# Altium schematic sheet LED.SchDoc
size A2
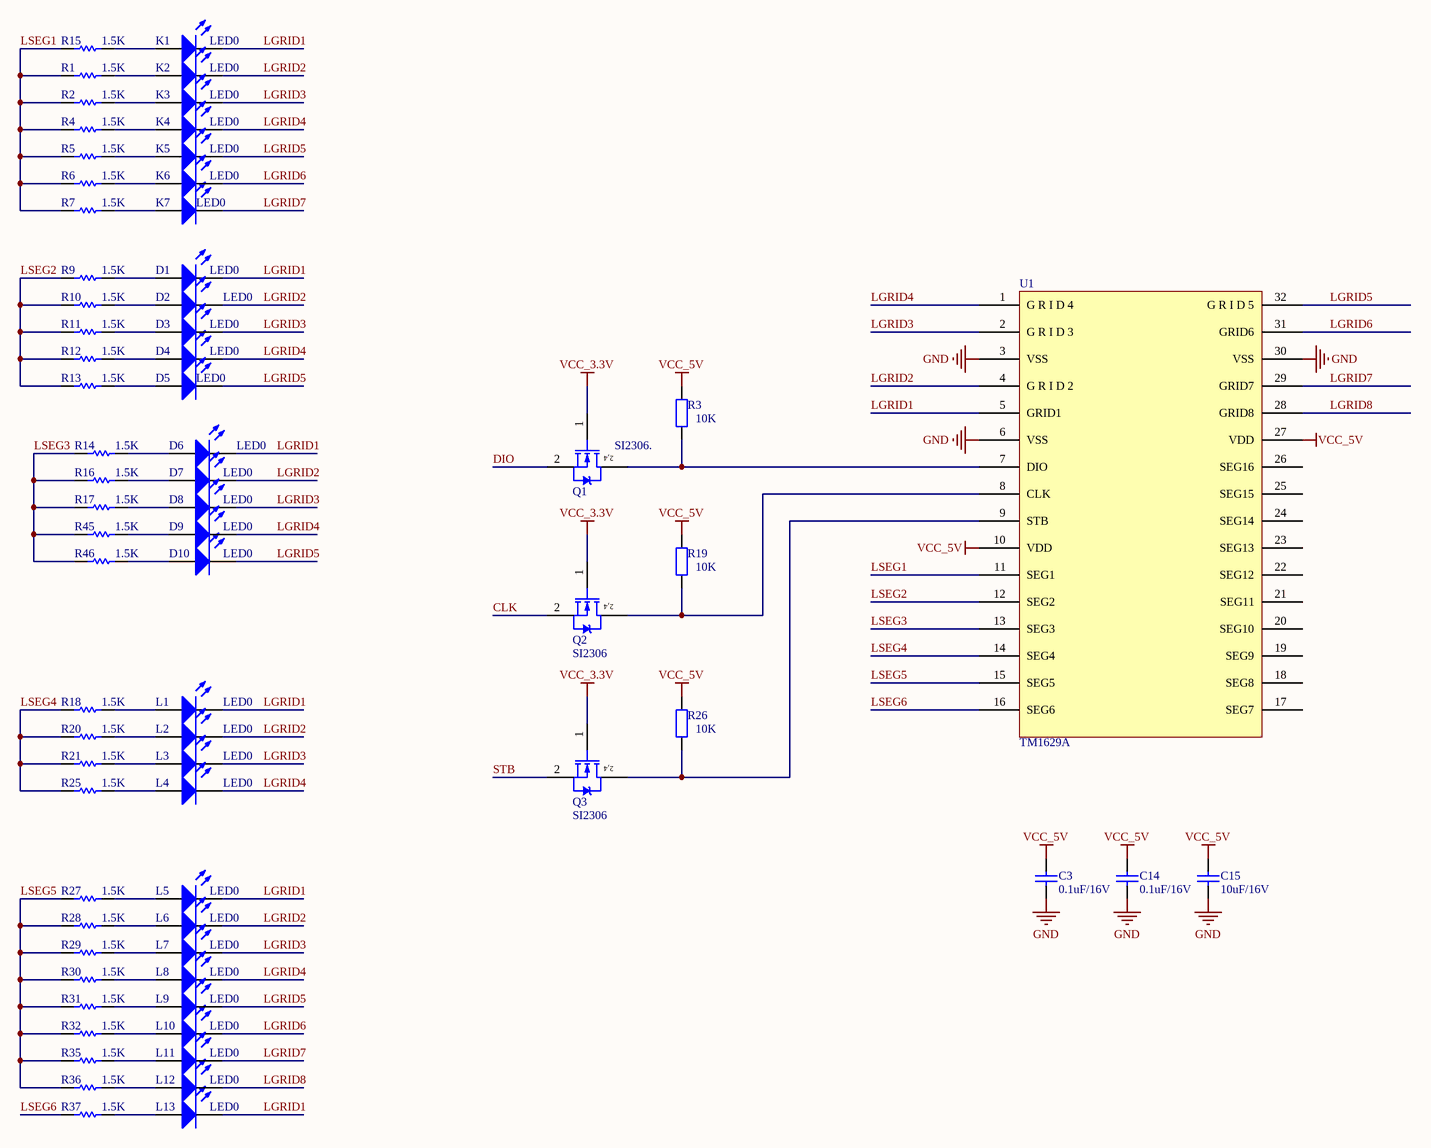
[diagram p0: LED.SchDoc]

## Parts
C3  0.1uF/16V  [0603C]
C14  0.1uF/16V  [0603C]
C15  10uF/16V  [0603C]
D1  LED0  [LED_DIP_257mm]
D2  LED0  [LED_DIP_257mm]
D3  LED0  [LED_DIP_257mm]
D4  LED0  [LED_DIP_257mm]
D5  LED0  [LED_DIP_257mm]
D6  LED0  [LED_DIP_257mm]
D7  LED0  [LED_DIP_257mm]
D8  LED0  [LED_DIP_257mm]
D9  LED0  [LED_DIP_257mm]
D10  LED0  [LED_DIP_257mm]
K1  LED0  [LED_DIP_5mm]
K2  LED0  [LED_DIP_5mm]
K3  LED0  [LED_DIP_5mm]
K4  LED0  [LED_DIP_5mm]
K5  LED0  [LED_DIP_5mm]
K6  LED0  [LED_DIP_5mm]
K7  LED0  [LED_DIP_5mm]
L1  LED0  [LED_DIP_5mm]
L2  LED0  [LED_DIP_5mm]
L3  LED0  [LED_DIP_5mm]
L4  LED0  [LED_DIP_5mm]
L5  LED0  [LED_DIP_257mm]
L6  LED0  [LED_DIP_257mm]
L7  LED0  [LED_DIP_257mm]
L8  LED0  [LED_DIP_257mm]
L9  LED0  [LED_DIP_257mm]
L10  LED0  [LED_DIP_257mm]
L11  LED0  [LED_DIP_257mm]
L12  LED0  [LED_DIP_257mm]
L13  LED0  [LED_DIP_257mm]
Q1  SI2306.  [SOT23-3]
Q2  SI2306  [SOT23-3]
Q3  SI2306  [SOT23-3]
R1  1.5K  [0603R]
R2  1.5K  [0603R]
R3  10K  [0603R]
R4  1.5K  [0603R]
R5  1.5K  [0603R]
R6  1.5K  [0603R]
R7  1.5K  [0603R]
R9  1.5K  [0603R]
R10  1.5K  [0603R]
R11  1.5K  [0603R]
R12  1.5K  [0603R]
R13  1.5K  [0603R]
R14  1.5K  [0603R]
R15  1.5K  [0603R]
R16  1.5K  [0603R]
R17  1.5K  [0603R]
R18  1.5K  [0603R]
R19  10K  [0603R]
R20  1.5K  [0603R]
R21  1.5K  [0603R]
R25  1.5K  [0603R]
R26  10K  [0603R]
R27  1.5K  [0603R]
R28  1.5K  [0603R]
R29  1.5K  [0603R]
R30  1.5K  [0603R]
R31  1.5K  [0603R]
R32  1.5K  [0603R]
R35  1.5K  [0603R]
R36  1.5K  [0603R]
R37  1.5K  [0603R]
R45  1.5K  [0603R]
R46  1.5K  [0603R]
U1  TM1629A  [SOP127P1040X265-32N]

## Nets
GND: C3.2 C14.2 C15.2 U1.3(VSS) U1.6(VSS) U1.30(VSS)
VCC_3.3V: Q1.1(G) Q2.1(G) Q3.1(G)
VCC_5V: C3.1 C14.1 C15.1 R3.1 R19.1 R26.1 U1.10(VDD) U1.27(VDD)
CLK: Q2.2(S)
DIO: Q1.2(S)
LGRID1: D1.2(K) D6.2(K) K1.2(K) L1.2(K) L5.2(K) L13.2(K) U1.5(GRID1)
LGRID2: D2.2(K) D7.2(K) K2.2(K) L2.2(K) L6.2(K) U1.4(G_R_I_D_2)
LGRID3: D3.2(K) D8.2(K) K3.2(K) L3.2(K) L7.2(K) U1.2(G_R_I_D_3)
LGRID4: D4.2(K) D9.2(K) K4.2(K) L4.2(K) L8.2(K) U1.1(G_R_I_D_4)
LGRID5: D5.2(K) D10.2(K) K5.2(K) L9.2(K) U1.32(G_R_I_D_5)
LGRID6: K6.2(K) L10.2(K) U1.31(GRID6)
LGRID7: K7.2(K) L11.2(K) U1.29(GRID7)
LGRID8: L12.2(K) U1.28(GRID8)
LSEG1: R1.2 R2.2 R4.2 R5.2 R6.2 R7.2 R15.2 U1.11(SEG1)
LSEG2: R9.2 R10.2 R11.2 R12.2 R13.2 U1.12(SEG2)
LSEG3: R14.2 R16.2 R17.2 R45.2 R46.2 U1.13(SEG3)
LSEG4: R18.2 R20.2 R21.2 R25.2 U1.14(SEG4)
LSEG5: R27.2 R28.2 R29.2 R30.2 R31.2 R32.2 R35.2 R36.2 U1.15(SEG5)
LSEG6: R37.2 U1.16(SEG6)
STB: Q3.2(S)
NetD1_1: D1.1(A) R9.1
NetD2_1: D2.1(A) R10.1
NetD3_1: D3.1(A) R11.1
NetD4_1: D4.1(A) R12.1
NetD5_1: D5.1(A) R13.1
NetD6_1: D6.1(A) R14.1
NetD7_1: D7.1(A) R16.1
NetD8_1: D8.1(A) R17.1
NetD9_1: D9.1(A) R45.1
NetD10_1: D10.1(A) R46.1
NetK1_1: K1.1(A) R15.1
NetK2_1: K2.1(A) R1.1
NetK3_1: K3.1(A) R2.1
NetK4_1: K4.1(A) R4.1
NetK5_1: K5.1(A) R5.1
NetK6_1: K6.1(A) R6.1
NetK7_1: K7.1(A) R7.1
NetL1_1: L1.1(A) R18.1
NetL2_1: L2.1(A) R20.1
NetL3_1: L3.1(A) R21.1
NetL4_1: L4.1(A) R25.1
NetL5_1: L5.1(A) R27.1
NetL6_1: L6.1(A) R28.1
NetL7_1: L7.1(A) R29.1
NetL8_1: L8.1(A) R30.1
NetL9_1: L9.1(A) R31.1
NetL10_1: L10.1(A) R32.1
NetL11_1: L11.1(A) R35.1
NetL12_1: L12.1(A) R36.1
NetL13_1: L13.1(A) R37.1
NetQ1_3: Q1.3(D) R3.2 U1.7(DIO)
NetQ2_3: Q2.3(D) R19.2 U1.8(CLK)
NetQ3_3: Q3.3(D) R26.2 U1.9(STB)

Not connected (* = marked no-connect by the designer): U1 17(SEG7) 18(SEG8) 19(SEG9) 20(SEG10) 21(SEG11) 22(SEG12) 23(SEG13) 24(SEG14) 25(SEG15) 26(SEG16)

## Notes on the sheet
- (in symbol BUK92150-55A) 2,4

## Library data of the parts
C3 C14 C15 = Cap: Capacitor; Value: 2.2uF/6.3V; Published: 8-Jun-2000; LatestRevisionDate: 17-Jul-2002; LatestRevisionNote: Re-released for DXP Platform.; PackageReference: RAD-0.3; Publisher: Altium Limited
D1-D10 K1-K7 L1-L13 = LED0: Typical INFRARED GaAs LED; Published: 8-Jun-2000; LatestRevisionDate: 08-Jul-2005; LatestRevisionNote: Mech Layer 1 removed.; PackageReference: LED-0; Publisher: Altium Limited
Q1-Q3 = BUK92150-55A: Published: 8-Jun-2000; LatestRevisionDate: 17-Jul-2002; LatestRevisionNote: Re-released for DXP Platform.; DatasheetVersion: 6-Oct-1997; PackageVersion: Aug-1998; PackageReference: TSOP-6; Publisher: Altium Limited; PackageDescription: SOT-457/SC-74; 6 Leads; Body 3.1 x 3 mm, inc. leads (LxW max); ComponentLink1Description: Manufacturer Link; ComponentLink1URL: http://www.vishay.com/; ComponentLink2Description: Datasheet; ComponentLink2URL: http://www.vishay.com/docs/70192/70192.pdf
R1 R2 R4-R7 R9-R18 R20 R21 R25 R27-R32 R35-R37 R45 R46 = Res1: Resistor; Value: 1K; Published: 8-Jun-2000; LatestRevisionDate: 17-Jul-2002; LatestRevisionNote: Re-released for DXP Platform.; PackageReference: AXIAL-0.3; Publisher: Altium Limited
R3 R19 R26 = Res2: Resistor; Value: 0; Published: 8-Jun-2000; LatestRevisionDate: 17-Jul-2002; LatestRevisionNote: Re-released for DXP Platform.; PackageReference: AXIAL-0.4; Publisher: Altium Limited